# Altium project BreadBoard Power Supply.PrjPcb
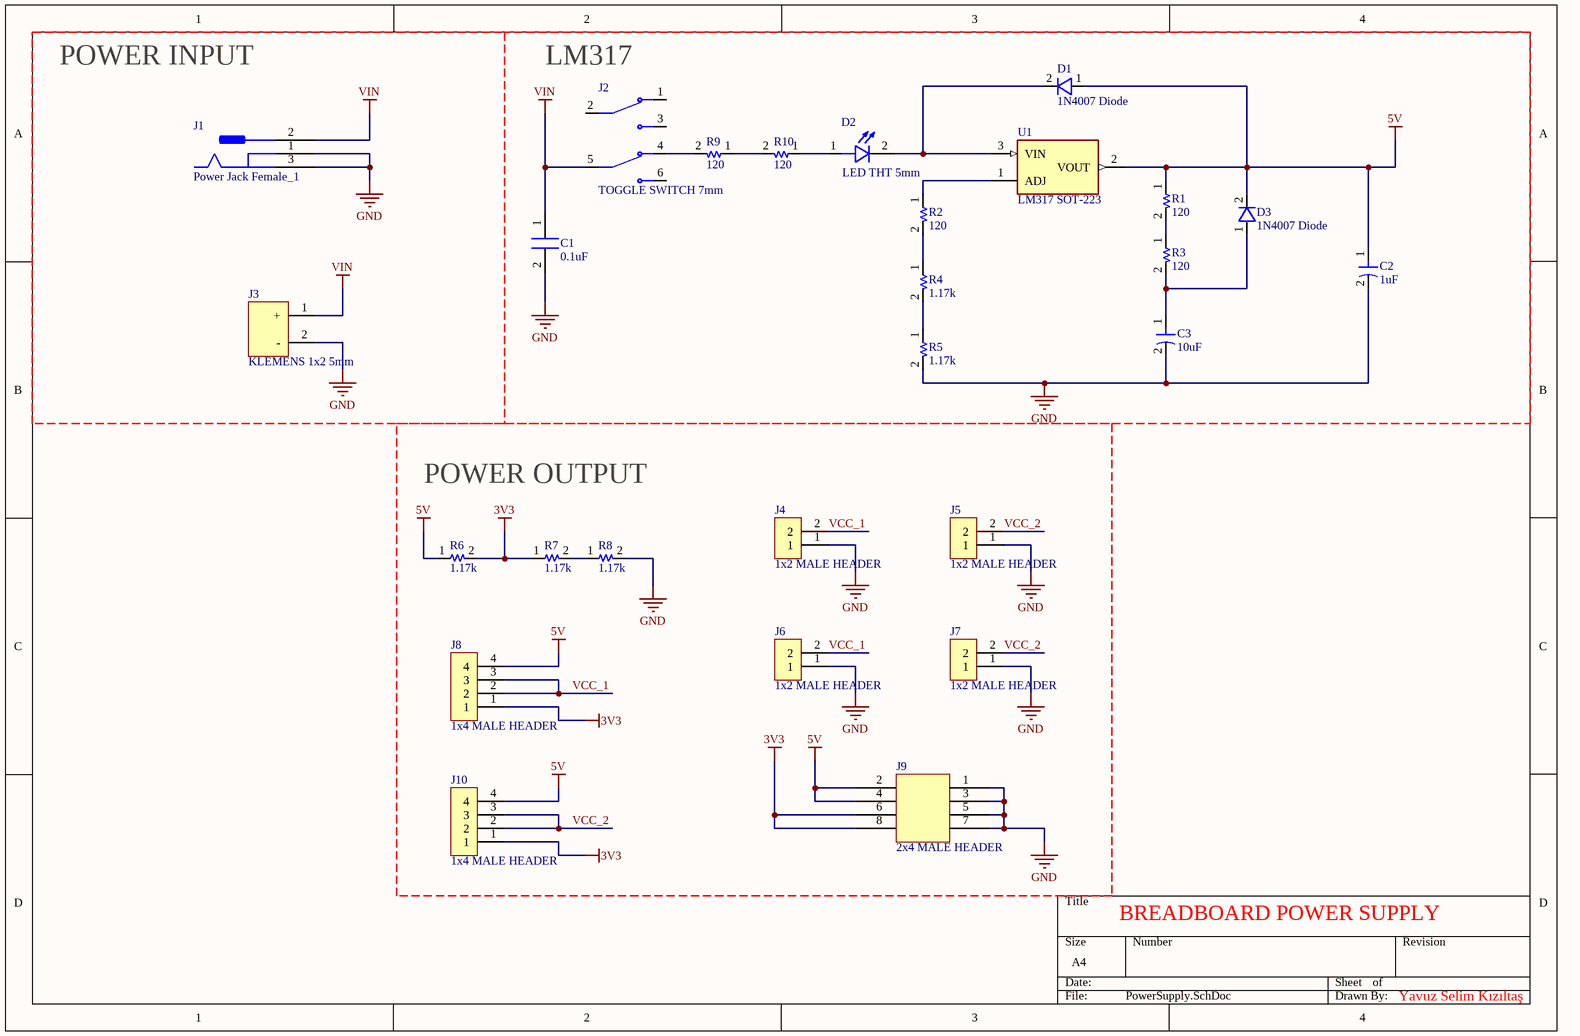
[diagram p0: PowerSupply.SchDoc]
1 sheet, 27 parts. Net scope: global (net labels, ports and power ports of the same name join across sheets).
Board file: PowerSupply.PcbDoc

## Sheet PowerSupply.SchDoc
size A4; SheetNumber: 1; SheetTotal: 1

### Parts
C1  0.1uF  [MERCIMEK CAPACITOR]
C2  1uF  [SMD CAPACITOR 3x5 mm]
C3  10uF  [SMD CAPACITOR 4x5 mm]
D1  1N4007 Diode  [1N4007 Diode]
D2  LED THT 5mm  [LED THT]
D3  1N4007 Diode  [1N4007 Diode]
J1  Power Jack Female_1  [Power Jack Female]
J2  TOGGLE SWITCH 7mm  [TOGGLE SWITCH 7mm]
J3  KLEMENS 1x2 5mm  [KLEMENS 1x2 5mm]
J4  1x2 MALE HEADER  [1x2 MALE HEADER - duplicate]
J5  1x2 MALE HEADER  [1x2 MALE HEADER - duplicate]
J6  1x2 MALE HEADER  [1x2 MALE HEADER - duplicate]
J7  1x2 MALE HEADER  [1x2 MALE HEADER - duplicate]
J8  1x4 MALE HEADER  [1x4 MALE HEADER]
J9  2x4 MALE HEADER  [2x4 Male header]
J10  1x4 MALE HEADER  [1x4 MALE HEADER]
R1  120  [R1206 Resıstor]
R2  120  [R1206 Resıstor]
R3  120  [R1206 Resıstor]
R4  1.17k  [RESISTOR THT]
R5  1.17k  [RESISTOR THT]
R6  1.17k  [RESISTOR THT]
R7  1.17k  [RESISTOR THT]
R8  1.17k  [RESISTOR THT]
R9  120  [R1206 Resıstor]
R10  120  [R1206 Resıstor]
U1  LM317 SOT-223  [LM317 SOT-223]

### Blocks framed on the sheet
POWER OUTPUT: J4-J10 R6-R8

### Nets
3V3: J8.1 J9.6 J9.8 J10.1 R6.2 R7.1
5V: C2.1 D1.1 D3.2 J8.4 J9.2 J9.4 J10.4 R1.1 R6.1 U1.2(VOUT)
GND: C1.2 C2.2 C3.2 J1.1 J1.3 J3.2(-) J4.1 J5.1 J6.1 J7.1 J9.1 J9.3 J9.5 J9.7 R5.2 R8.2
VIN: C1.1 J1.2(VCC) J2.5(COM2) J3.1(+)
VCC_1: J4.2 J6.2 J8.2 J8.3
VCC_2: J5.2 J7.2 J10.2 J10.3
NetC3_1: C3.1 D3.1 R3.2
NetD1_2: D1.2 D2.2(C) U1.3(VIN)
NetD2_1: D2.1(A) R10.1
NetJ2_4: J2.4(NC2) R9.2
NetR1_2: R1.2 R3.1
NetR2_1: R2.1 U1.1(ADJ)
NetR2_2: R2.2 R4.1
NetR4_2: R4.2 R5.1
NetR7_2: R7.2 R8.1
NetR9_1: R9.1 R10.2

Not connected (* = marked no-connect by the designer): J2 1(NC1) 2(COM1) 3(NO1) 6(NO2)

### Notes on the sheet
- POWER INPUT
- (near J2) LM317
- BREADBOARD POWER SUPPLY
- Yavuz Selim Kızıltaş

### Library data of the parts
C1 = MERCIMEK CAPACITOR
C2 = SMD CAPACITOR 3x5mm
C3 = SMD CAPACITOR 4x5mm
R1-R3 R9 R10 = R1206
R4-R8 = RESISTOR THT